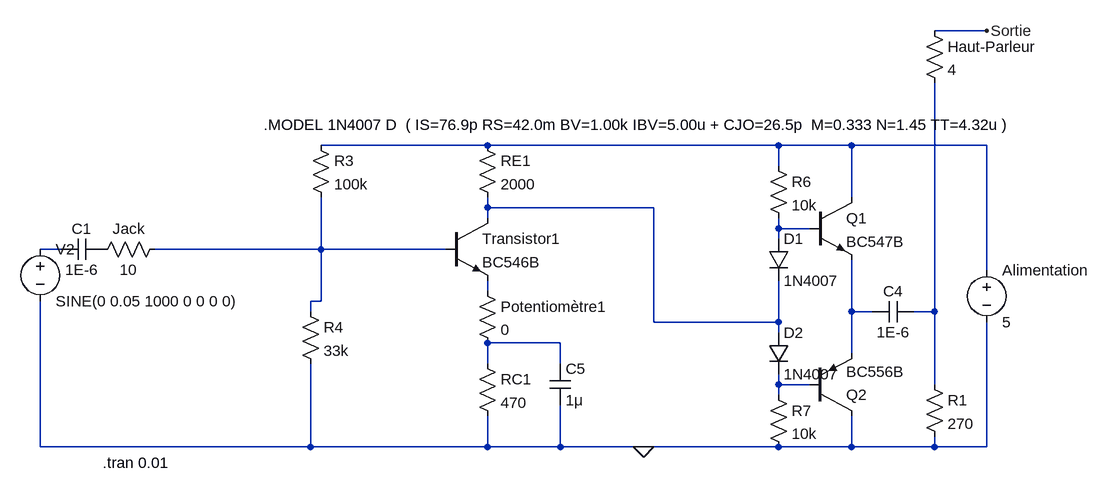
[diagram p0: schematic Livrable N°3 Circuit classe A + PushPull.asc]
Livrable N°3 Circuit classe A + PushPull.asc, the LTspice schematic file:
Version 4
SHEET 1 2696 1204
WIRE 1760 -160 1680 -160
WIRE 992 16 736 16
WIRE 1440 16 992 16
WIRE 1552 16 1440 16
WIRE 1760 16 1552 16
WIRE 1440 48 1440 16
WIRE 1552 96 1552 16
WIRE 992 112 992 96
WIRE 1248 112 992 112
WIRE 992 128 992 112
WIRE 1440 144 1440 128
WIRE 1488 144 1440 144
WIRE 1440 160 1440 144
WIRE 336 176 304 176
WIRE 736 176 736 96
WIRE 736 176 480 176
WIRE 928 176 736 176
WIRE 1760 208 1760 16
WIRE 992 240 992 224
WIRE 736 256 736 176
WIRE 736 256 720 256
WIRE 720 272 720 256
WIRE 1552 272 1552 192
WIRE 1584 272 1552 272
WIRE 1680 272 1680 -80
WIRE 1680 272 1648 272
WIRE 1248 288 1248 112
WIRE 1440 288 1440 224
WIRE 1440 288 1248 288
WIRE 1440 304 1440 288
WIRE 1104 320 992 320
WIRE 1552 336 1552 272
WIRE 992 352 992 320
WIRE 1104 352 1104 320
WIRE 1440 384 1440 368
WIRE 1488 384 1440 384
WIRE 1680 384 1680 272
WIRE 1440 400 1440 384
WIRE 304 480 304 256
WIRE 720 480 720 352
WIRE 720 480 304 480
WIRE 992 480 992 432
WIRE 992 480 720 480
WIRE 1104 480 1104 416
WIRE 1104 480 992 480
WIRE 1232 480 1104 480
WIRE 1440 480 1232 480
WIRE 1552 480 1552 432
WIRE 1552 480 1440 480
WIRE 1680 480 1680 464
WIRE 1680 480 1552 480
WIRE 1760 480 1760 288
WIRE 1760 480 1680 480
FLAG 1232 480 0
FLAG 1760 -160 Sortie
SYMBOL voltage 304 160 R0
WINDOW 123 24 124 Left 2
WINDOW 39 0 0 Left 0
SYMATTR InstName V2
SYMATTR Value SINE(0 0.05 1000 0 0 0 0)
SYMBOL res 496 160 R90
WINDOW 0 0 56 VBottom 2
WINDOW 3 32 56 VTop 2
SYMATTR InstName Jack
SYMATTR Value 10
SYMBOL res 976 0 R0
SYMATTR InstName RE1
SYMATTR Value 2000
SYMBOL res 976 336 R0
SYMATTR InstName RC1
SYMATTR Value 470
SYMBOL res 720 0 R0
SYMATTR InstName R3
SYMATTR Value 100k
SYMBOL res 704 256 R0
SYMATTR InstName R4
SYMATTR Value 33k
SYMBOL npn 928 128 R0
SYMATTR InstName Transistor1
SYMATTR Value BC546B
SYMBOL voltage 1760 192 R0
WINDOW 123 0 0 Left 0
WINDOW 39 0 0 Left 0
SYMATTR InstName Alimentation
SYMATTR Value 5
SYMBOL cap 1088 352 R0
SYMATTR InstName C5
SYMATTR Value 1μ
SYMBOL res 976 224 R0
SYMATTR InstName Potentiomètre1
SYMATTR Value 0
SYMBOL res 1424 32 R0
SYMATTR InstName R6
SYMATTR Value 10k
SYMBOL res 1424 384 R0
SYMATTR InstName R7
SYMATTR Value 10k
SYMBOL diode 1424 160 R0
SYMATTR InstName D1
SYMATTR Value 1N4007
SYMBOL diode 1424 304 R0
SYMATTR InstName D2
SYMATTR Value 1N4007
SYMBOL npn 1488 96 R0
SYMATTR InstName Q1
SYMATTR Value BC547B
SYMBOL pnp 1488 432 M180
SYMATTR InstName Q2
SYMATTR Value BC556B
SYMBOL cap 1648 256 R90
WINDOW 0 0 32 VBottom 2
WINDOW 3 32 32 VTop 2
SYMATTR InstName C4
SYMATTR Value 1E-6
SYMBOL cap 400 160 R90
WINDOW 0 0 32 VBottom 2
WINDOW 3 32 32 VTop 2
SYMATTR InstName C1
SYMATTR Value 1E-6
SYMBOL res 1664 -176 R0
SYMATTR InstName Haut-Parleur
SYMATTR Value 4
SYMBOL res 1664 368 R0
SYMATTR InstName R1
SYMATTR Value 270
TEXT 400 504 Left 2 !.tran 0.01
TEXT 648 -16 Left 2 !.MODEL 1N4007 D  ( IS=76.9p RS=42.0m BV=1.00k IBV=5.00u + CJO=26.5p  M=0.333 N=1.45 TT=4.32u )

The netlist it stands for:
* Livrable N°3 Circuit classe A + PushPull.asc
V2 N004 0 SINE(0 0.05 1000 0 0 0 0)
R§Jack N005 P001 10
RE1 N001 N002 2000
RC1 N009 0 470
R3 N001 N005 100k
R4 N005 0 33k
Q§Transistor1 N002 N005 N006 0 BC546B
V§Alimentation N001 0 5
C5 N009 0 1μ
R§Potentiomètre1 N006 N009 0
R6 N001 N003 10k
R7 N010 0 10k
D1 N003 N002 1N4007
D2 N002 N010 1N4007
Q1 N001 N003 N007 0 BC547B
Q2 0 N010 N007 0 BC556B
C4 N008 N007 1E-6
C1 P001 N004 1E-6
R§Haut-Parleur Sortie N008 4
R1 N008 0 270
.model D D
.lib standard.dio
.model NPN NPN
.model PNP PNP
.lib standard.bjt
.tran 0.01
.MODEL 1N4007 D  ( IS=76.9p RS=42.0m BV=1.00k IBV=5.00u + CJO=26.5p  M=0.333 N=1.45 TT=4.32u )
.backanno
.end